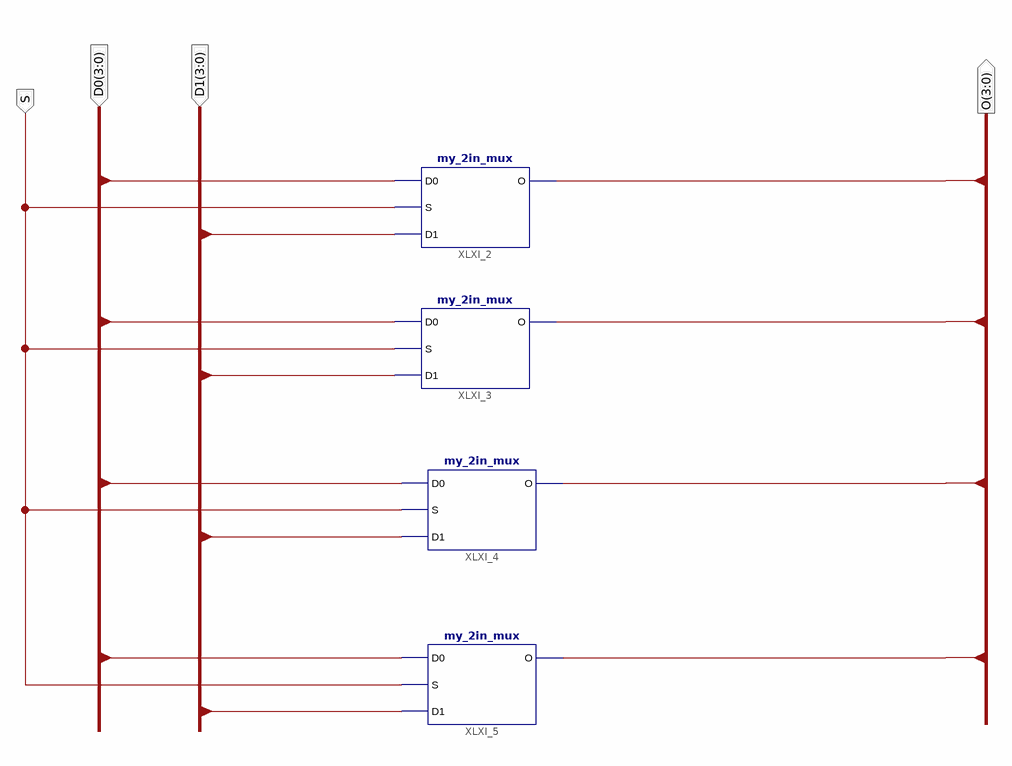
[diagram p0: schematic sheet 1]
// Xilinx ISE schematic mux4_2to1.sch (virtex6) as structural Verilog: 4 symbols, 4 ports
module mux4_2to1 (
  input  [3:0] D0,
  input  [3:0] D1,
  input  S,
  output [3:0] O
);

  wire XLXN_8, XLXN_13, XLXN_14, XLXN_15, XLXN_16, XLXN_17, XLXN_18, XLXN_19, XLXN_20, XLXN_21, XLXN_22,
       XLXN_23;

  my_2in_mux XLXI_2 (.D0(XLXN_16), .D1(XLXN_17), .O(XLXN_15), .S(S));
  my_2in_mux XLXI_3 (.D0(XLXN_18), .D1(XLXN_19), .O(XLXN_13), .S(S));
  my_2in_mux XLXI_4 (.D0(XLXN_20), .D1(XLXN_21), .O(XLXN_14), .S(S));
  my_2in_mux XLXI_5 (.D0(XLXN_22), .D1(XLXN_23), .O(XLXN_8), .S(S));
endmodule
